# Altium project 20W Deathsound Preamp.PrjPcb
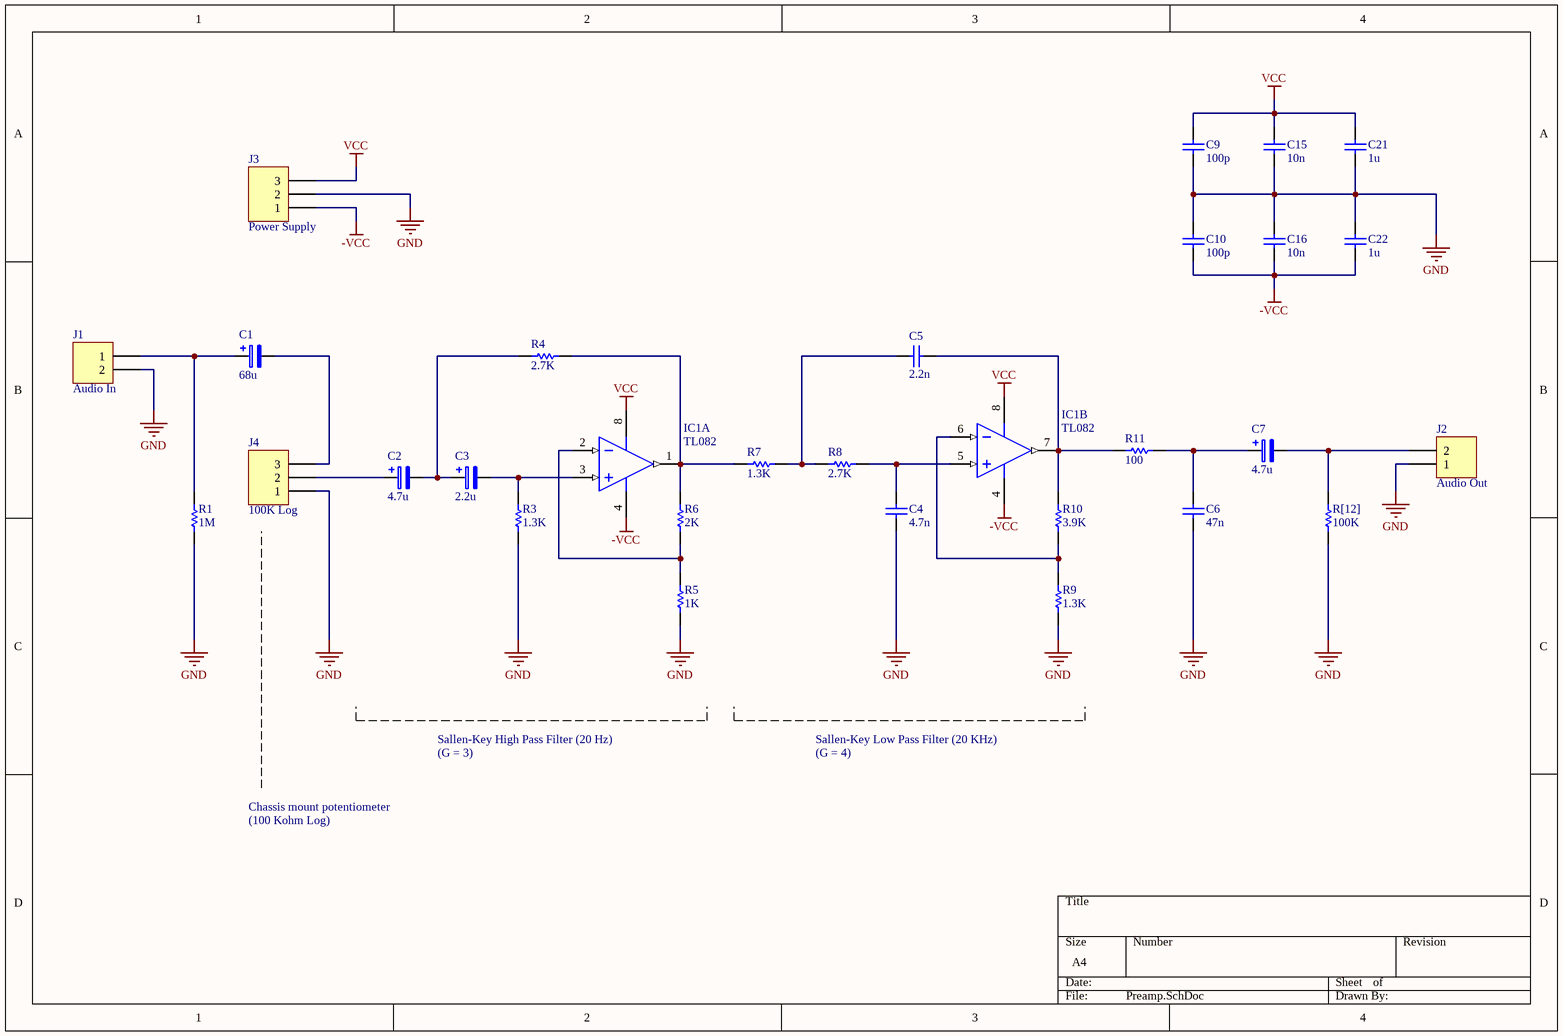
[diagram p0: Preamp.SchDoc]
1 sheet, 29 parts. Net scope: global (net labels, ports and power ports of the same name join across sheets).
Board file: Preamp.PcbDoc

## Sheet Preamp.SchDoc
size A4

### Parts
C1  68u  [CRADIAL-2.5mm]
C2  4.7u  [CRADIAL-2mm]
C3  2.2u  [CRADIAL-2mm]
C4  4.7n  [C0805]
C5  2.2n  [C0805]
C6  47n  [C1206]
C7  4.7u  [CRADIAL-2mm]
C9  100p  [C0805]
C10  100p  [C0805]
C15  10n  [C0805]
C16  10n  [C0805]
C21  1u  [C0805]
C22  1u  [C0805]
IC1  TL082  [SOIC127P600X175-8N]  (parts A,B of 2)
J1  Audio In  [2 Pin 5mm Terminal Block]
J2  Audio Out  [2 Pin 5mm Terminal Block]
J3  Power Supply  [3 Pin 5mm Terminal Block]
J4  100K Log  [3 Pin 5mm Terminal Block]
R1  1M  [R0805]
R3  1.3K  [R0805]
R4  2.7K  [R0805]
R5  1K  [R0805]
R6  2K  [R0805]
R7  1.3K  [R0805]
R8  2.7K  [R0805]
R9  1.3K  [R0805]
R10  3.9K  [R0805]
R11  100  [R0805]
R[12]  100K  [R0805]

### Nets
-VCC: C10.1 C16.1 C22.1 IC1.4(V-) J3.1
GND: C4.1 C6.1 C9.1 C10.2 C15.1 C16.2 C21.1 C22.2 J1.2 J2.1 J3.2 J4.1 R1.1 R3.1 R5.2 R9.1 R[12].2
VCC: C9.2 C15.2 C21.2 IC1.8(V+) J3.3
NetC1_1: C1.1 J1.1 R1.2
NetC1_2: C1.2 J4.3
NetC2_1: C2.1 J4.2
NetC2_2: C2.2 C3.1 R4.2
NetC3_2: C3.2 IC1.3(IN+1) R3.2
NetC4_2: C4.2 IC1.5(IN+2) R8.2
NetC5_1: C5.1 IC1.7(OUT2) R10.2 R11.2
NetC5_2: C5.2 R7.2 R8.1
NetC6_2: C6.2 C7.1 R11.1
NetC7_2: C7.2 J2.2 R[12].1
NetIC1_1: IC1.1(OUT1) R4.1 R6.1 R7.1
NetIC1_2: IC1.2(IN-1) R5.1 R6.2
NetIC1_6: IC1.6(IN-2) R9.2 R10.1

### Notes on the sheet
- Sallen-Key High Pass Filter (20 Hz)
- (G = 3)
- Sallen-Key Low Pass Filter (20 KHz)
- (G = 4)
- Chassis mount potentiometer
- (100 Kohm Log)

### Library data of the parts
C1-C3 C7 = Pol Capacitor: Polarized Capacitor
  C1: Value: 68u
  C2 C7: Value: 4.7u
  C3: Value: 2.2u
C4-C6 C9 C10 C15 C16 C21 C22 = Capacitor
  C4: Value: 4.7n
  C5: Value: 2.2n
  C6: Value: 47n
  C9 C10: Value: 100p
  C15 C16: Value: 10n
  C21 C22: Value: 1u
J1 J2 = Terminal Block 2 Pin: Terminal Block, 2 Pin
J3 J4 = Terminal Block 3 Pin: Terminal Block, 3 Pin
R1 R3-R11 R[12] = Resistor
  R1: Value: 1M
  R3 R7 R9: Value: 1.3K
  R4 R8: Value: 2.7K
  R5: Value: 1K
  R6: Value: 2K
  R10: Value: 3.9K
  R11: Value: 100
  R[12]: Value: 100K